# Altium schematic sheet mipi-lcd-type-1080p.SchDoc
size A4; DocumentNumber: 1; SheetNumber: 1; SheetTotal: 1
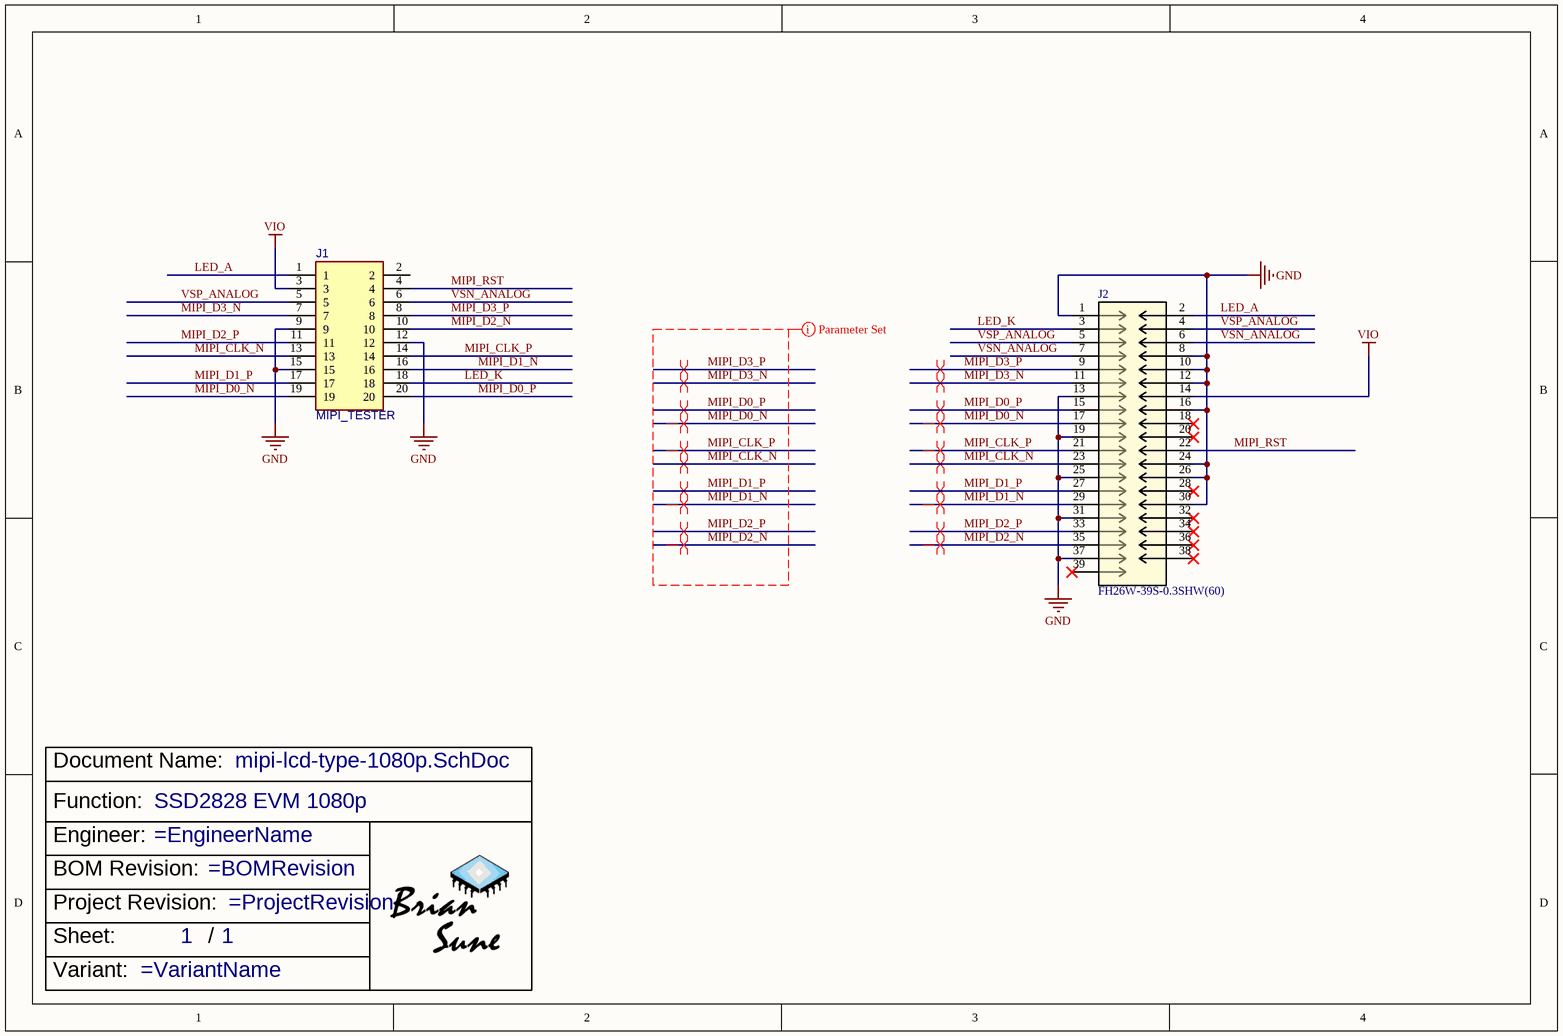
[diagram p0: mipi-lcd-type-1080p.SchDoc]

## Parts
?  Function: SSD2828 EVM 1080p  (hidden comment: TitleBlock)  (graphical)
J1  MIPI_TESTER  [20IN]
J2  FH26W-39S-0.3SHW(60)  [CONN39_FH26W-39S-0.3SHW(60)_HIR]

## Nets
GND: J1.9 J1.12 J1.15 J2.1 J2.8 J2.10 J2.12 J2.13 J2.16 J2.19 J2.24 J2.25 J2.26 J2.30 J2.31 J2.37
VIO: J1.3 J2.14
LED_A: J1.1 J2.2
LED_K: J1.18 J2.3
MIPI_CLK_N: J1.13 J2.23
MIPI_CLK_P: J1.14 J2.21
MIPI_D0_N: J1.19 J2.17
MIPI_D0_P: J1.20 J2.15
MIPI_D1_N: J1.16 J2.29
MIPI_D1_P: J1.17 J2.27
MIPI_D2_N: J1.10 J2.35
MIPI_D2_P: J1.11 J2.33
MIPI_D3_N: J1.7 J2.11
MIPI_D3_P: J1.8 J2.9
MIPI_RST: J1.4 J2.22
VSN_ANALOG: J1.6 J2.6 J2.7
VSP_ANALOG: J1.5 J2.4 J2.5

Not connected (* = marked no-connect by the designer): J1 2; J2 18* 20* 28* 32* 34* 36* 38* 39*

## Layout directives
differential pair: MIPI_CLK_N, MIPI_CLK_P, MIPI_D0_N, MIPI_D0_P, MIPI_D1_N, MIPI_D1_P, MIPI_D2_N, MIPI_D2_P, MIPI_D3_N, MIPI_D3_P
net class MIPI_SIG: MIPI_CLK_N, MIPI_CLK_P, MIPI_D0_N, MIPI_D0_P, MIPI_D1_N, MIPI_D1_P, MIPI_D2_N, MIPI_D2_P, MIPI_D3_N, MIPI_D3_P

## Notes on the sheet
- (in symbol TitleBlock) Document Name:; Function:; Engineer:; BOM Revision:; Project Revision:; Sheet:; /; Variant:

## Library data of the parts
J1 = 20P_MIPI
J2 = FH26W-39S-0.3SHW(60): No Description Available; Mfr_Name: Hirose; Copyright: Copyright (C) 2022 Ultra Librarian. All rights reserved.; Manufacturer_Part_Number: FH26W-39S-0.3SHW(60); RefDes: RefDes; Type: DEV